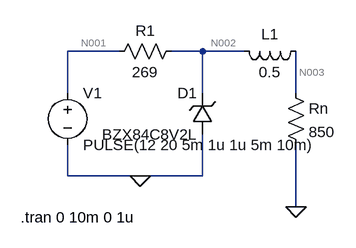
[diagram p0: schematic task11.asc]
task11.asc, the LTspice schematic file:
Version 4.1
SHEET 1 880 680
WIRE 144 48 64 48
WIRE 272 48 224 48
WIRE 336 48 272 48
WIRE 64 112 64 48
WIRE 272 112 272 48
WIRE 416 112 416 48
WIRE 64 240 64 192
WIRE 176 240 64 240
WIRE 272 240 272 176
WIRE 272 240 176 240
WIRE 416 288 416 192
FLAG 176 240 0
FLAG 416 288 0
SYMBOL voltage 64 96 R0
WINDOW 123 0 0 Left 0
WINDOW 39 0 0 Left 0
SYMATTR InstName V1
SYMATTR Value PULSE(12 20 5m 1u 1u 5m 10m)
SYMBOL res 240 32 R90
WINDOW 0 0 56 VBottom 2
WINDOW 3 32 56 VTop 2
SYMATTR InstName R1
SYMATTR Value 269
SYMBOL res 400 96 R0
SYMATTR InstName Rn
SYMATTR Value 850
SYMBOL zener 288 176 R180
WINDOW 0 24 64 Left 2
WINDOW 3 24 0 Left 2
SYMATTR InstName D1
SYMATTR Value BZX84C8V2L
SYMBOL ind 432 32 R90
WINDOW 0 5 56 VBottom 2
WINDOW 3 32 56 VTop 2
SYMATTR InstName L1
SYMATTR Value 0.5
SYMATTR SpiceLine Rser=1m
TEXT -8 304 Left 2 !.tran 0 10m 0 1u

The netlist it stands for:
* task11.asc
V1 N001 0 PULSE(12 20 5m 1u 1u 5m 10m)
R1 N002 N001 269
Rn N003 0 850
D1 0 N002 BZX84C8V2L
L1 N003 N002 0.5 Rser=1m
.model D D
.lib standard.dio
.tran 0 10m 0 1u
.backanno
.end

* Results of the author's LTspice run, read from the files saved beside the schematic
* Operating Point, zero values left out:
*   V(n001) = 12 V
*   V(n002) = 8.309 V
*   V(n003) = 8.309 V
*   I(D1) = -3.948 mA
*   I(L1) = -9.775 mA
*   I(R1) = -13.72 mA
*   I(Rn) = 9.775 mA
*   I(V1) = -13.72 mA
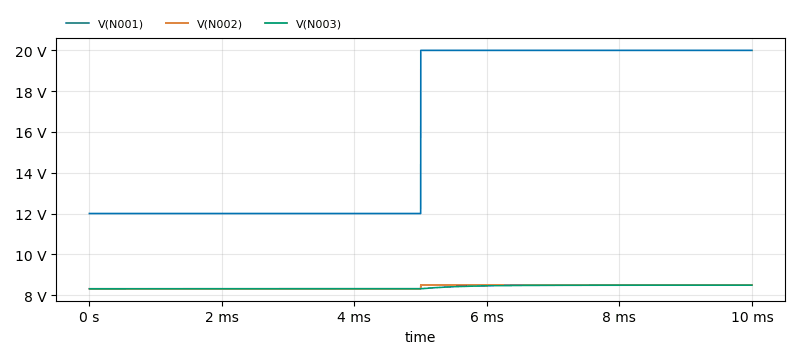
[diagram p1: Transient Analysis of task11.asc, plotted from the saved traces]
* Transient Analysis, 1 run:
*   V(N001): min 12 V, max 20 V, average 16 V, rms 16.49 V, last 20 V
*   V(N002): min 8.309 V, max 8.488 V, average 8.398 V, rms 8.398 V, last 8.487 V
*   V(N003): min 8.309 V, max 8.487 V, average 8.387 V, rms 8.388 V, last 8.487 V